# EAGLE design StairLightController (EAGLE 9.6.2)
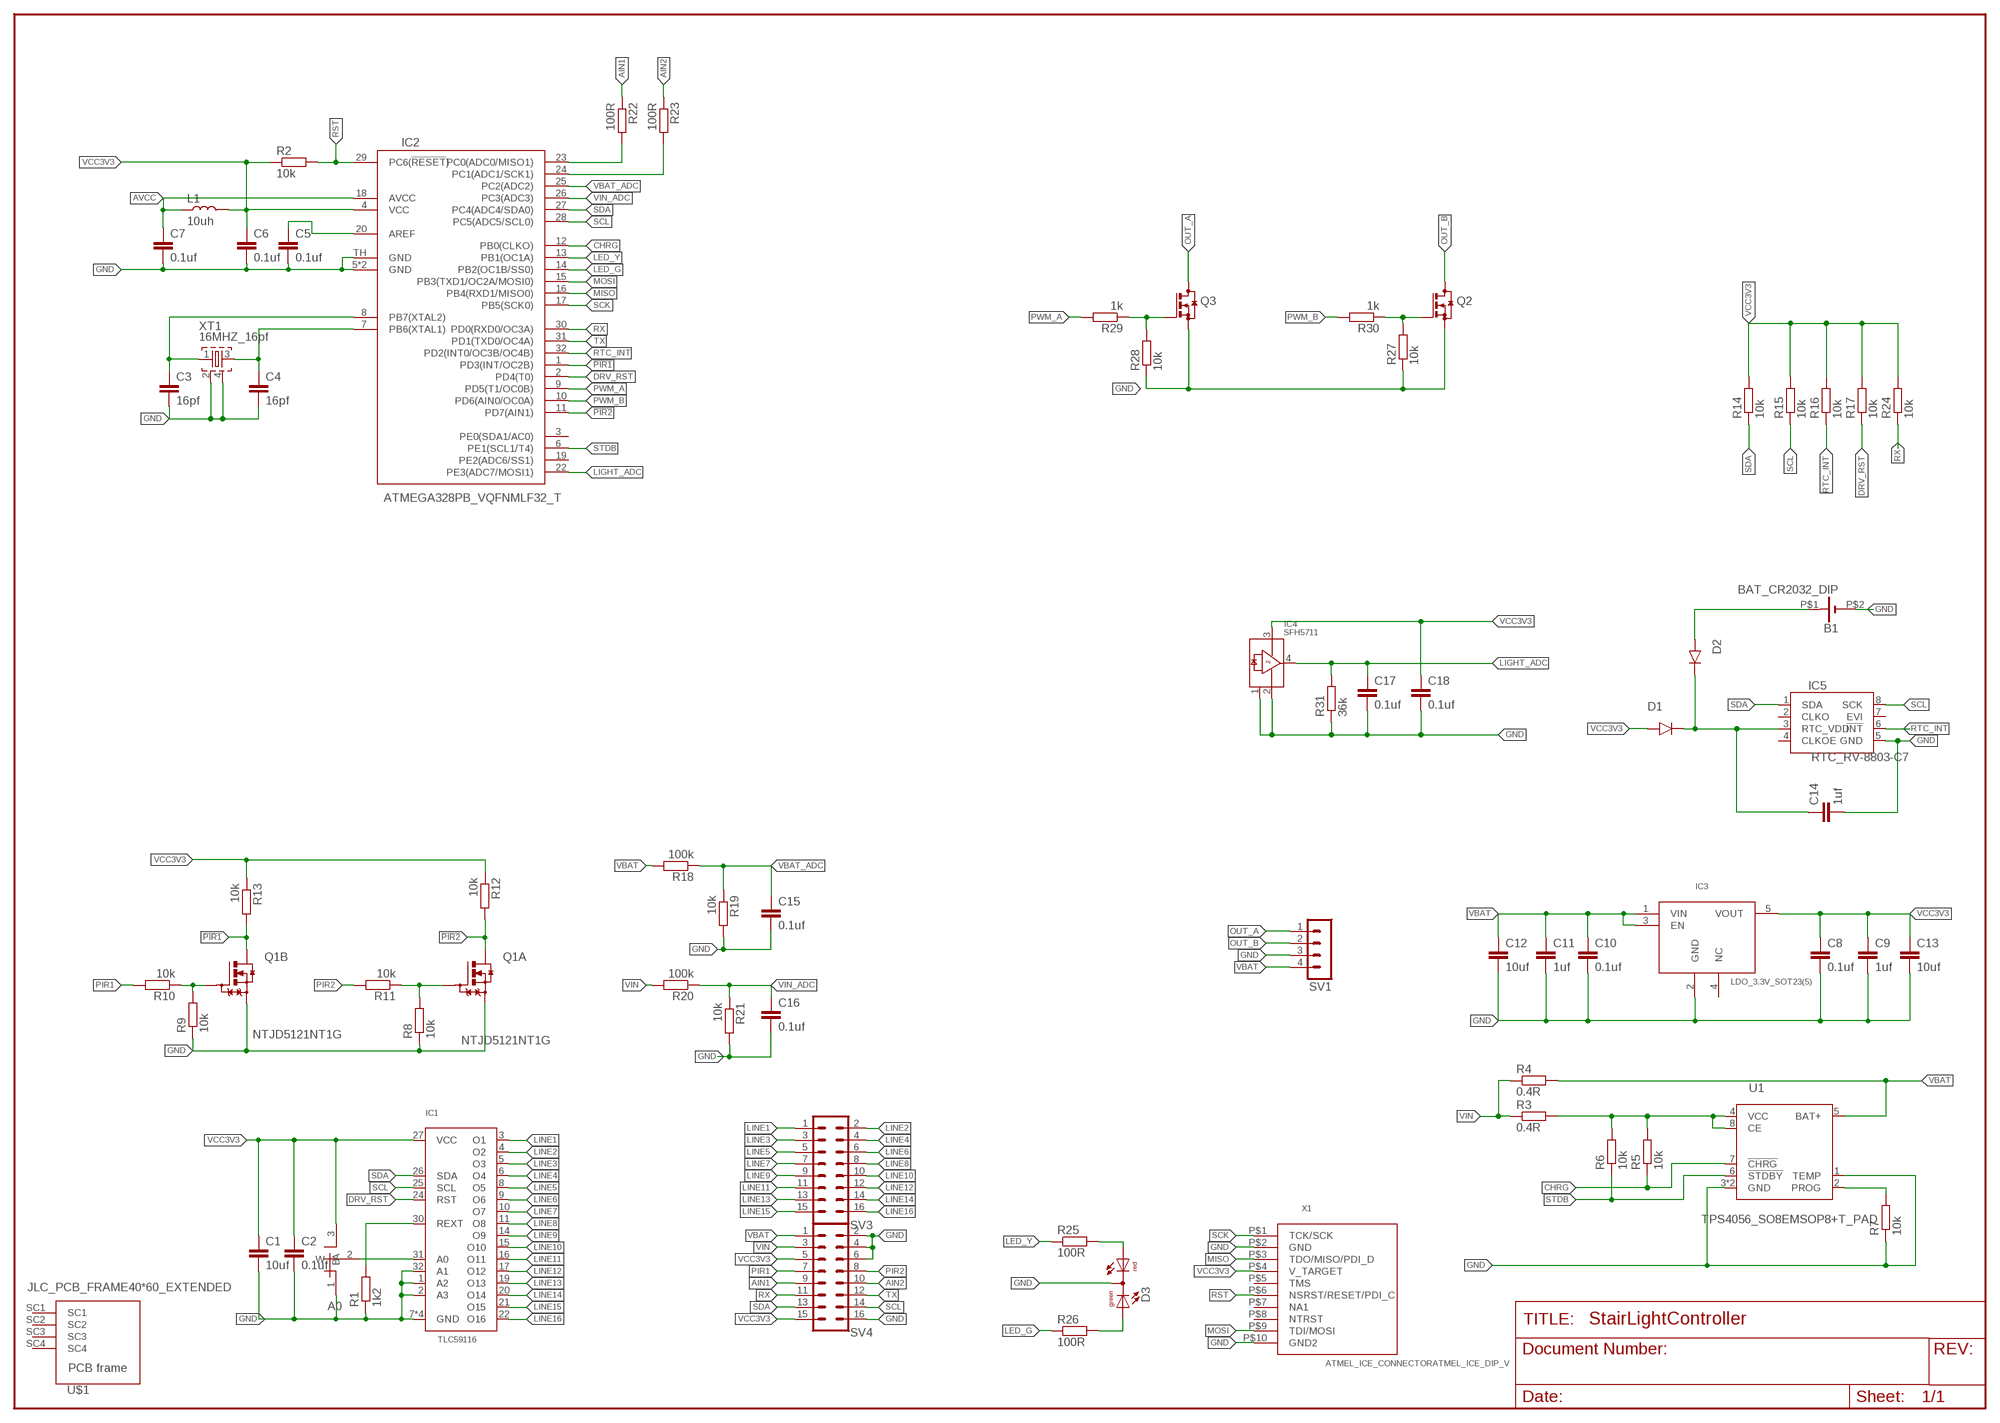
[diagram p0: schematic, sheet 1]

## Parts
A0  SMD_SWITCH_JUMPER  [0603_JUMP]
B1  BAT_CR2032_DIP  [CR2032_DIP]
C1  10uf  SMD_C0603  [0603]
C2  0.1uf  SMD_C0603  [0603]
C3  16pf  SMD_C0603  [0603]
C4  16pf  SMD_C0603  [0603]
C5  0.1uf  SMD_C0603  [0603]
C6  0.1uf  SMD_C0603  [0603]
C7  0.1uf  SMD_C0603  [0603]
C8  0.1uf  SMD_C0603  [0603]
C9  1uf  SMD_C0603  [0603]
C10  0.1uf  SMD_C0603  [0603]
C11  1uf  SMD_C0603  [0603]
C12  10uf  SMD_C1206  [1206]
C13  10uf  SMD_C1206  [1206]
C14  1uf  SMD_C0603  [0603]
C15  0.1uf  SMD_C0603  [0603]
C16  0.1uf  SMD_C0603  [0603]
C17  0.1uf  SMD_C0603  [0603]
C18  0.1uf  SMD_C0603  [0603]
D1  L1N4148WT1GSOD123_GALILE0_SMALL  [SOD-123_MINI-SMA]
D2  L1N4148WT1GSOD123_GALILE0_SMALL  [SOD-123_MINI-SMA]
D3  DUOLED5MM  [DUOLED5MM]
IC1  TLC59116  [MLF32-TH]
IC2  ATMEGA328PB_VQFNMLF32_T  [MLF32-TH]
IC3  LDO_3.3V_SOT23(5)  [SOT-23(5)]
IC4  SFH5711  [SFH5711]
IC5  RTC_RV-8803-C7  [C7_RTC]
L1  10uh  SMD_L0603  [0603]
Q1  NTJD5121NT1G  [SOT363]
Q2  BSS123SOT-23-3  [SOT-23(3)]
Q3  BSS123SOT-23-3  [SOT-23(3)]
R1  1k2  SMD_R0603  [0603]
R2  10k  SMD_R0603  [0603]
R3  0.4R  SMD_R1206  [1206]
R4  0.4R  SMD_R1206  [1206]
R5  10k  SMD_R0603  [0603]
R6  10k  SMD_R0603  [0603]
R7  10k  SMD_R0603  [0603]
R8  10k  SMD_R0603  [0603]
R9  10k  SMD_R0603  [0603]
R10  10k  SMD_R0603  [0603]
R11  10k  SMD_R0603  [0603]
R12  10k  SMD_R0603  [0603]
R13  10k  SMD_R0603  [0603]
R14  10k  SMD_R0603  [0603]
R15  10k  SMD_R0603  [0603]
R16  10k  SMD_R0603  [0603]
R17  10k  SMD_R0603  [0603]
R18  100k  SMD_R0603  [0603]
R19  10k  SMD_R0603  [0603]
R20  100k  SMD_R0603  [0603]
R21  10k  SMD_R0603  [0603]
R22  100R  SMD_R0603  [0603]
R23  100R  SMD_R0603  [0603]
R24  10k  SMD_R0603  [0603]
R25  100R  SMD_R0603  [0603]
R26  100R  SMD_R0603  [0603]
R27  10k  SMD_R0603  [0603]
R28  10k  SMD_R0603  [0603]
R29  1k  SMD_R0603  [0603]
R30  1k  SMD_R0603  [0603]
R31  36k  SMD_R0603  [0603]
SV1  MA04-1  [MA04-1]
SV3  MA08-2  [MA08-2]
SV4  MA08-2  [MA08-2]
U1  TPS4056_SO8EMSOP8+T_PAD  [EMSOP8+TPAD]
U$1  JLC_PCB_FRAME40*60_EXTENDED  [40X60_SENSOR_UNIT_OPEN]
X1  ATMEL_ICE_CONNECTORATMEL_ICE_DIP_V  [MINI10P_SPI/JTAG/PDI_DIP_V]
XT1  16MHZ_16pf  QUARTZ_ZQ  [QUARTZ_3X3MM]

## Nets
!PIR1: IC2.1(PD3(INT/OC2B)) Q1.3(B:D) R13.2
!PIR2: IC2.11(PD7(AIN1)) Q1.6(A:D) R12.2
AIN1: R22.1 SV4.9
AIN2: R23.1 SV4.10
AVCC: C7.1 IC2.18(AVCC) L1.1
CHRG: IC2.12(PB0(CLKO)) R5.1 U1.7(!CHRG)
DRV_RST: IC1.24(RST) IC2.2(PD4(T0)) R17.1
GND: A0.1(A) B1.P$2(-) C1.2 C2.2 C3.2 C4.2 C5.2 C6.2 C7.2 C8.2 C9.2 C10.2 C11.2 C12.2 C13.2 C14.2 C15.2 C16.2 C17.2 C18.2 D3.K(C) IC1.1(A2) IC1.2(A3) IC1.7(GND) IC1.18(GND) IC1.23(GND) IC1.32(A1) IC1.TH(GND) IC2.5(GND) IC2.21(GND) IC2.TH(GND) IC3.2(GND) IC4.1 IC4.2 IC5.5(GND) Q1.1(A:S) Q1.4(B:S) Q2.2(S) Q3.2(S) R1.1 R7.1 R8.1 R9.1 R19.2 R21.2 R27.1 R28.1 R31.1 SV1.3 SV4.2 SV4.4 SV4.6 SV4.16 U1.1(TEMP) U1.3(GND) U1.TPAD(GND) X1.P$2(GND) X1.P$10(GND2) XT1.2 XT1.4
LED_G: IC2.14(PB2(OC1B/SS0)) R26.1
LED_Y: IC2.13(PB1(OC1A)) R25.1
LIGHT_ADC: C17.1 IC2.22(PE3(ADC7/MOSI1)) IC4.4 R31.2
LINE1: IC1.3(O1) SV3.1
LINE2: IC1.4(O2) SV3.2
LINE3: IC1.5(O3) SV3.3
LINE4: IC1.6(O4) SV3.4
LINE5: IC1.8(O5) SV3.5
LINE6: IC1.9(O6) SV3.6
LINE7: IC1.10(O7) SV3.7
LINE8: IC1.11(O8) SV3.8
LINE9: IC1.14(O9) SV3.9
LINE10: IC1.15(O10) SV3.10
LINE11: IC1.16(O11) SV3.11
LINE12: IC1.17(O12) SV3.12
LINE13: IC1.19(O13) SV3.13
LINE14: IC1.20(O14) SV3.14
LINE15: IC1.21(O15) SV3.15
LINE16: IC1.22(O16) SV3.16
MISO: IC2.16(PB4(RXD1/MISO0)) X1.P$3(TDO/MISO/PDI_D)
MOSI: IC2.15(PB3(TXD1/OC2A/MOSI0)) X1.P$9(TDI/MOSI)
N$1: A0.2(W) IC1.31(A0)
N$2: IC1.30(REXT) R1.2
N$3: C3.1 IC2.8(PB7(XTAL2)) XT1.1
N$4: C4.1 IC2.7(PB6(XTAL1)) XT1.3
N$5: R7.2 U1.2(PROG)
N$6: R3.2 R5.2 R6.2 U1.4(VCC) U1.8(CE)
N$7: C5.1 IC2.20(AREF)
N$8: IC2.23(PC0(ADC0/MISO1)) R22.2
N$9: Q1.2(A:G) R8.2 R11.1
N$10: D3.AR R25.2
N$11: Q1.5(B:G) R9.2 R10.1
N$12: IC2.24(PC1(ADC1/SCK1)) R23.2
N$13: C14.1 D1.C D2.C IC5.3(RTC_VDD)
N$14: D3.AG R26.2
N$16: Q2.1(G) R27.2 R30.1
N$17: B1.P$1(+) D2.A
N$18: Q3.1(G) R28.2 R29.1
OUT_A: Q3.3(D) SV1.1
OUT_B: Q2.3(D) SV1.2
PIR1: R10.2 SV4.7
PIR2: R11.2 SV4.8
PWM_A: IC2.9(PD5(T1/OC0B)) R29.2
PWM_B: IC2.10(PD6(AIN0/OC0A)) R30.2
RST: IC2.29(PC6(!RESET!)) R2.2 X1.P$6(NSRST/RESET/PDI_C)
RTC_INT: IC2.32(PD2(INT0/OC3B/OC4B)) IC5.6(!INT) R16.1
RX: IC2.30(PD0(RXD0/OC3A)) R24.1 SV4.11
SCK: IC2.17(PB5(SCK0)) X1.P$1(TCK/SCK)
SCL: IC1.25(SCL) IC2.28(PC5(ADC5/SCL0)) IC5.8(SCK) R15.1 SV4.14
SDA: IC1.26(SDA) IC2.27(PC4(ADC4/SDA0)) IC5.1(SDA) R14.1 SV4.13
STDB: IC2.6(PE1(SCL1/T4)) R6.1 U1.6(!STDBY)
TX: IC2.31(PD1(TXD0/OC4A)) SV4.12
VBAT: C10.1 C11.1 C12.1 IC3.1(VIN) IC3.3(EN) R4.2 R18.2 SV1.4 SV4.1 U1.5(BAT+)
VBAT_ADC: C15.1 IC2.25(PC2(ADC2)) R18.1 R19.1
VCC3V3: A0.3(B) C1.1 C2.1 C6.1 C8.1 C9.1 C13.1 C18.1 D1.A IC1.27(VCC) IC2.4(VCC) IC3.5(VOUT) IC4.3 L1.2 R2.1 R12.1 R13.1 R14.2 R15.2 R16.2 R17.2 R24.2 SV4.5 SV4.15 X1.P$4(V_TARGET)
VIN: R3.1 R4.1 R20.2 SV4.3
VIN_ADC: C16.1 IC2.26(PC3(ADC3)) R20.1 R21.1
Unconnected: IC2.3(PE0(SDA1/AC0)) IC2.19(PE2(ADC6/SS1)) IC3.4(NC) IC5.2(CLKO) IC5.4(CLKOE) IC5.7(EVI) U$1.SC1 U$1.SC2 U$1.SC3 U$1.SC4 X1.P$5(TMS) X1.P$7(NA1) X1.P$8(NTRST)

## Library data of the parts
A0 = passive_components:SMD_SWITCH_JUMPER
B1 = passive_components:BAT_CR2032_DIP
C1-C18 = passive_components:SMD_C
D1 D2 = passive_components:L1N4148WT1G
D3 = led:DUOLED5MM: DUO LED 2 colors, 5 mm, round
IC1 = my_IC:TLC59116
IC2 = my_IC:ATMEGA328PB_VQFN
IC3 = my_IC:LDO_3.3V_SOT23(5)
IC4 = SFH5711:SFH5711; AVAILABILITY: Unavailable; DESCRIPTION: Optical Sensor Ambient 555nm Current 4-SMD, No Lead; MF: OSRAM Opto; MP: SFH5711; PACKAGE: SMD-4 OSRAM Opto; PRICE: None
IC5 = my_IC:RTC_RV-8803-C7
L1 = passive_components:SMD_L
Q1 = on-semiconductor-ntjd5121nt1g:NTJD5121NT1G: NTJD5121N, Dual N−Channel with ESD Power MOSFET 60 V, 295 mA, Dual N−Channel with ESD Protection, SC−88 Source: Datasheet <http://www.farnell.com/datasheets/1708304.pdf>; MF: ON SEMICONDUCTOR; MPN: NTJD5121NT1G; OC_FARNELL: 2317611; OC_NEWARK: unknown
Q2 Q3 = passive_components:BSS123: N-CHANNEL MOS FET
R1-R31 = passive_components:SMD_R
SV1 = con-lstb:MA04-1: PIN HEADER; OC_FARNELL: unknown; OC_NEWARK: unknown
SV3 SV4 = con-lstb:MA08-2: PIN HEADER; OC_FARNELL: unknown; OC_NEWARK: unknown
U1 = my_IC:TPS4056_SO8
U$1 = passive_components:JLC_PCB_FRAME
X1 = passive_components:ATMEL_ICE_CONNECTOR
XT1 = passive_components:QUARTZ_ZQ

## Board
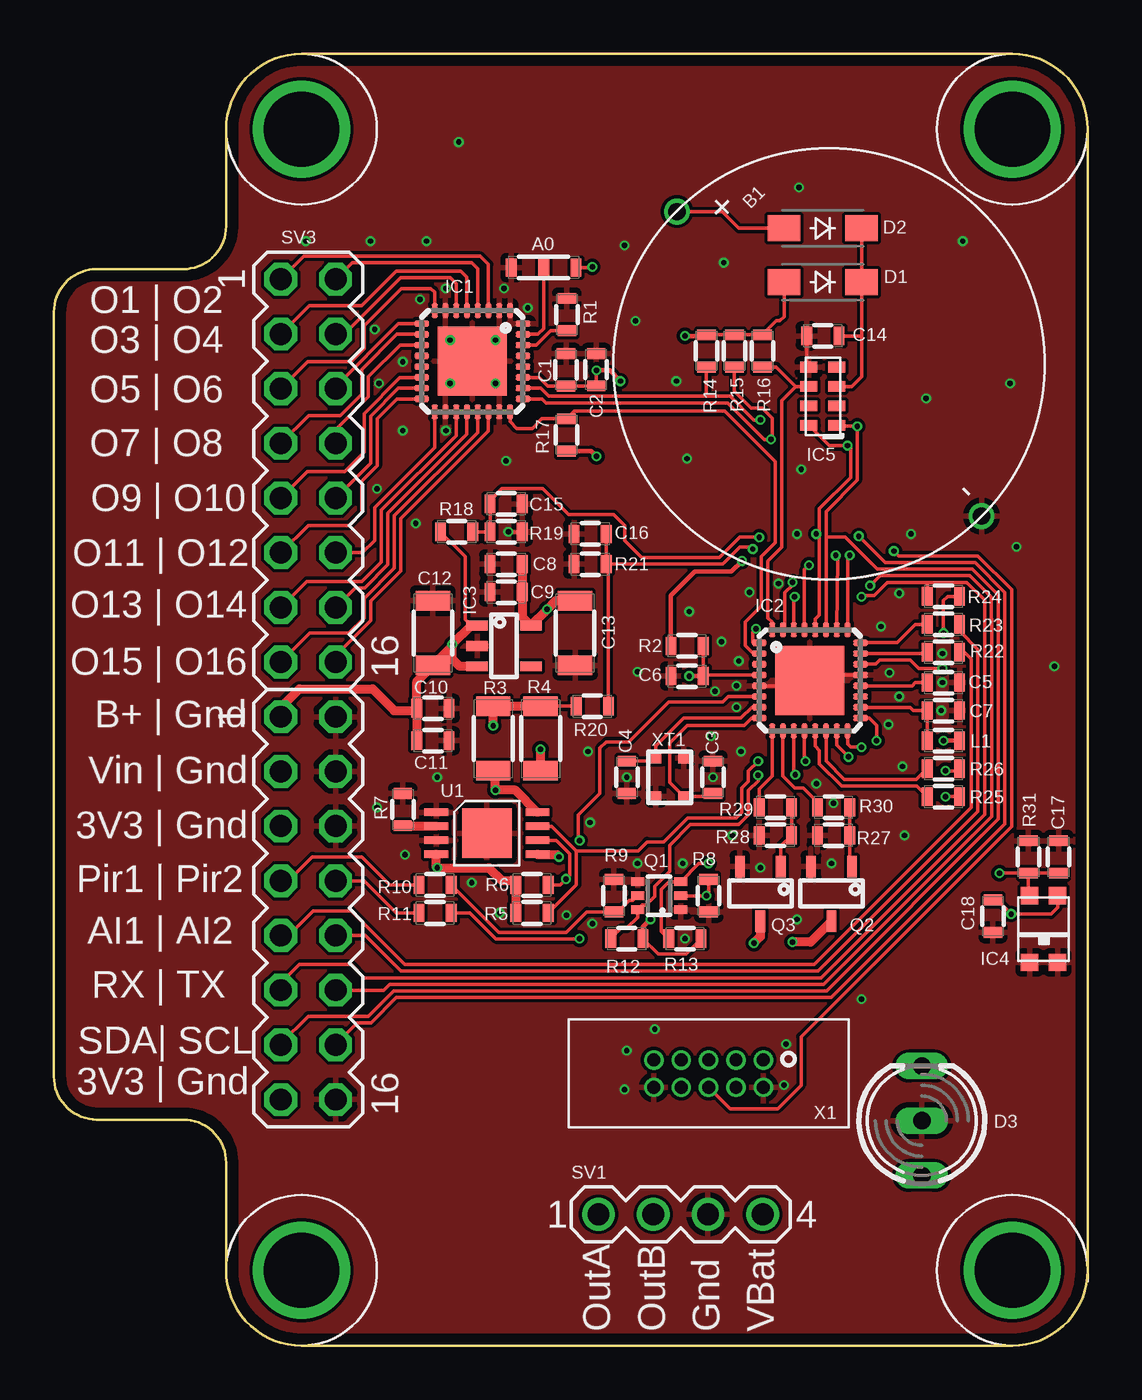
[diagram p1: board, top side]
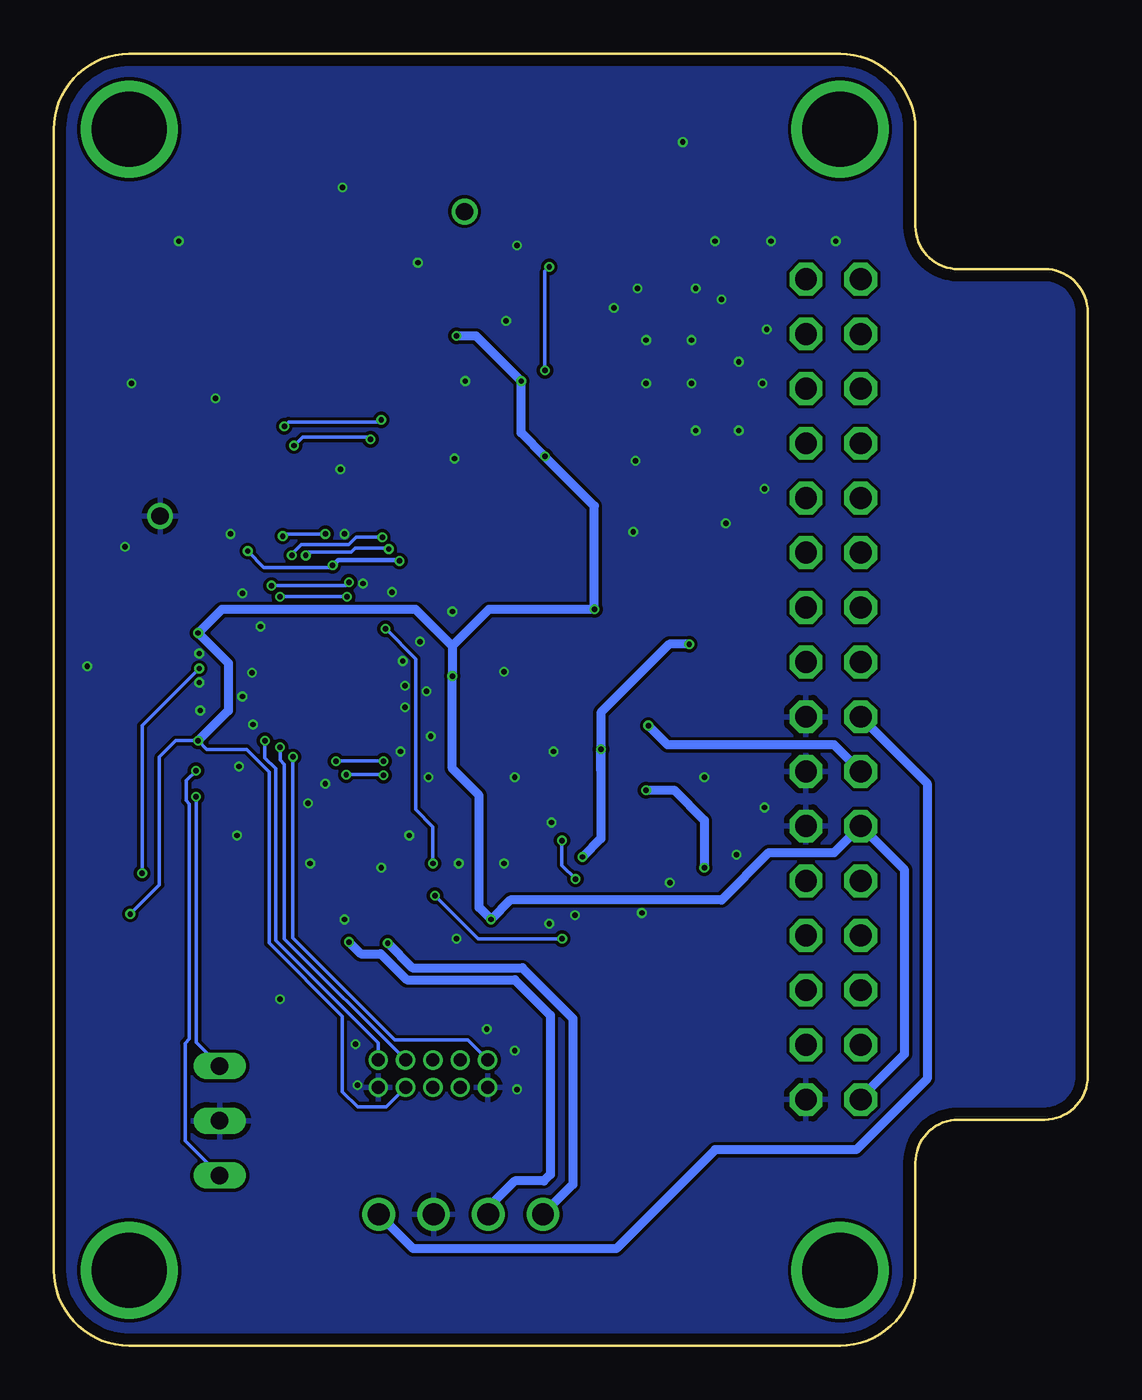
[diagram p2: board, bottom side, seen from below]

Size 48 x 60 mm. Coordinates in mm from the lower left corner, seen from the top.
Copper layers (1*16): Top 0.035mm / dielectric 0.15mm / Bottom 0.035mm
Design rules "default *": minimum track width 6mil, minimum drill 0.25mm, track to track 6mil, track to pad 6mil, pad to pad 6mil, via to via 6mil, smd to smd 6mil, copper to edge 20mil, drill to drill 6mil, minimum pad ring 4mil, minimum via ring 4mil, stop-mask expansion 4mil, vias tented up to drill 10mil, thermal gap 10mil

### Footprints (pad centres in the part's own frame; a part is rotated, then mirrored left to right if it is on the bottom)
0603_JUMP = smd 0.85 x 0.5: 1 0,0.75; 2 0,-0.75; 3 0,-2.25
CR2032_DIP = drill 0.8: P$1 -10,0; P$2 10,0
0603 = smd 0.85 x 0.5: 1 0,0.75; 2 0,-0.75
1206 = smd 1.6 x 0.9: 1 0,1.5; 2 0,-1.5
SOD-123_MINI-SMA = smd 1.5 x 1.2: A 1.8,0; C -1.8,0
DUOLED5MM = drill 0.813 long: AG -2.54,0; AR 2.54,0; K 0,0
MLF32-TH = smd 0.7 x 0.3: 1 -2.35,1.75; 2 -2.35,1.25; 3 -2.35,0.75; 4 -2.35,0.25; 5 -2.35,-0.25; 6 -2.35,-0.75; 7 -2.35,-1.25; 8 -2.35,-1.75; 17 2.35,-1.75; 18 2.35,-1.25; 19 2.35,-0.75; 20 2.35,-0.25; 21 2.35,0.25; 22 2.35,0.75; 23 2.35,1.25; 24 2.35,1.75 | smd 0.3 x 0.7: 9 -1.75,-2.35; 10 -1.25,-2.35; 11 -0.75,-2.35; 12 -0.25,-2.35; 13 0.25,-2.35; 14 0.75,-2.35; 15 1.25,-2.35; 16 1.75,-2.35; 25 1.75,2.35; 26 1.25,2.35; 27 0.75,2.35; 28 0.25,2.35; 29 -0.25,2.35; 30 -0.75,2.35; 31 -1.25,2.35; 32 -1.75,2.35 | smd 3.2 x 3.2: TH 0,0
SOT-23(5) = smd 0.45 x 1: 1 -0.95,-1.25; 2 0,-1.25; 3 0.95,-1.25; 4 0.95,1.25; 5 -0.95,1.25
SFH5711 = smd 0.8 x 0.8: 1 -0.65,-1.55; 2 0.65,-1.55; 3 0.65,1.55; 4 -0.65,1.55
C7_RTC = smd 0.8 x 0.5: 1 -0.65,1.35; 2 -0.65,0.45; 3 -0.65,-0.45; 4 -0.65,-1.35; 5 0.65,-1.35; 6 0.65,-0.45; 7 0.65,0.45; 8 0.65,1.35
SOT363 = smd 0.4 x 0.6: 1 -0.65,-1; 2 0,-1; 3 0.65,-1; 4 0.65,1; 5 0,1; 6 -0.65,1
SOT-23(3) = smd 0.45 x 1: 1 -0.95,-1.25; 2 0.95,-1.25; 3 0,1.29
MA04-1 = drill 1.016: 1 -3.81,0; 2 -1.27,0; 3 1.27,0; 4 3.81,0
MA08-2 = drill 1.016 octagon: 1 -8.89,-1.27; 2 -8.89,1.27; 3 -6.35,-1.27; 4 -6.35,1.27; 5 -3.81,-1.27; 6 -3.81,1.27; 7 -1.27,-1.27; 8 -1.27,1.27; 9 1.27,-1.27; 10 1.27,1.27; 11 3.81,-1.27; 12 3.81,1.27; 13 6.35,-1.27; 14 6.35,1.27; 15 8.89,-1.27; 16 8.89,1.27
EMSOP8+TPAD = smd 0.35 x 1.1: 1 -0.975,-2.35; 2 -0.325,-2.35; 3 0.325,-2.35; 4 0.975,-2.35; 5 0.975,2.35; 6 0.325,2.35; 7 -0.325,2.35; 8 -0.975,2.35 | smd 2.3 x 2.3: TPAD 0,0
40X60_SENSOR_UNIT_OPEN = drill 3.5: SC1 3.5,56.5; SC2 36.5,56.5; SC3 3.5,3.5; SC4 36.5,3.5
MINI10P_SPI/JTAG/PDI_DIP_V = drill 0.6: P$1 -2.54,-1.27; P$2 -2.54,0; P$3 -1.27,-1.27; P$4 -1.27,0; P$5 0,-1.27; P$6 0,0; P$7 1.27,-1.27; P$8 1.27,0; P$9 2.54,-1.27; P$10 2.54,0
QUARTZ_3X3MM = smd 0.5 x 0.5: 1 -0.65,0.9; 2 0.65,0.9; 3 0.65,-0.9; 4 -0.65,-0.9

### Placement (x,y rotation side)
A0  21.99,50.07 90 top
B1  36,45.6 315 top
C1  23.78,45.32 180 top
C2  25.18,45.33 180 top
C3  30.6,26.4 180 top
C4  26.6,26.4 0 top
C5  41.3,30.8 90 top
C6  29.4,31.1 270 top
C7  41.3,29.5 90 top
C8  21,36.3 270 top
C9  21,35 270 top
C10  17.6,29.6 90 top
C11  17.6,28.1 90 top
C12  17.6,33.1 180 top
C13  24.2,33.1 0 top
C14  35.7,46.9 270 top
C15  21,39.1 90 top
C16  24.9,37.7 270 top
C17  46.65,22.7 180 top
C18  43.6,19.95 0 top
D1  35.7,49.4 180 top
D2  35.7,51.9 180 top
D3  40.3,10.45 90 top
IC1  19.43,45.72 270 top
IC2  35.1,30.9 0 top
IC3  20.9,32.5 270 top
IC4  45.95,19.35 0 top
IC5  35.7,44.1 180 top
L1  41.3,28.1 90 top
Q1  28.1,20.9 90 top
Q2  36.1,21 180 top
Q3  32.8,21 180 top
R1  23.82,47.89 0 top
R2  29.4,32.5 270 top
R3  20.4,28.2 0 top
R4  22.6,28.2 0 top
R5  22.2,20.1 270 top
R6  22.2,21.4 270 top
R7  16.2,24.9 0 top
R8  30.4,20.9 180 top
R9  26,20.9 0 top
R10  17.7,21.4 270 top
R11  17.7,20.1 270 top
R12  26.6,18.9 270 top
R13  29.3,18.9 270 top
R14  30.3,46.2 180 top
R15  31.6,46.2 180 top
R16  32.9,46.2 180 top
R17  23.8,42.3 0 top
R18  18.7,37.8 270 top
R19  21,37.8 90 top
R20  25,29.7 270 top
R21  24.9,36.3 270 top
R22  41.3,32.2 270 top
R23  41.3,33.5 270 top
R24  41.3,34.8 90 top
R25  41.3,25.5 90 top
R26  41.3,26.8 90 top
R27  36.2,23.7 90 top
R28  33.5,23.7 90 top
R29  33.5,25 270 top
R30  36.2,25 270 top
R31  45.25,22.7 0 top
SV1  29.1,6.1 0 top
SV3  11.81,40.64 270 top
SV4  11.81,20.32 270 top
U1  20.1,23.8 270 top
U$1  8,0 0 top
X1  30.4,12 180 top
XT1  28.6,26.4 180 top

### Tracks (layer width: path | path; a pad name or v marks a point on that pad's centre or on a via)
!PIR1  (via drill 0.25)
  Top 0.152: R13.2 28.2,19.25 28.2,21.2 28.55,21.55 Q1.3 29.95,22.4 v30.4,22.4 | v32.6,33.3 32.45,33.15 32.45,32.65 IC2.1
  Bottom 0.152: v30.4,22.4 30.4,24.1 31.2,24.9 31.2,31.9 v32.6,33.3
!PIR2  (via drill 0.25)
  Top 0.152: R12.2 26.35,19.4 26.6,19.4 27.1,19.9 Q1.6 27.32,20.47 27.5,20.47 27.89,20.87 27.89,21.33 28.6,22.03 28.6,23.24 29.56,24.2 31.8,24.2 32.25,24.64 32.25,25.78 32.7,26.23 v32.7,26.5 | v34.42,26.52 34.35,26.59 IC2.11
  Bottom 0.152: v32.7,26.5 32.72,26.52 v34.42,26.52
AIN1
  Top 0.152: SV4.9 10.9,19.05 | 10.9,19.05 10.95,19.05 | R22.1 42.3,32.2 42.6,31.9 42.6,25 35.3,17.7 16.3,17.7 13.8,20.2 12.05,20.2 10.9,19.05
AIN2
  Top 0.152: SV4.10 14.45,19.05 16.11,17.39 35.5,17.39 42.91,24.8 42.91,32.34 42.05,33.2 R23.1
AVCC
  Top 0.152: IC2.18 39.75,29.65 39.9,29.5 40.5,29.5 | 40.5,29.5 C7.1 | L1.1 40.55,29.45 40.5,29.5
CHRG  (via drill 0.25)
  Top 0.152: U1.7 23.11,24.12 24.25,22.98 | R5.1 24.25,21.41 24.25,22.98 | 24.25,22.98 27.13,22.98 27.55,23.4 28.32,23.4 29.43,24.5 31.67,24.5 31.94,24.77 31.94,25.9 32.25,26.21 32.25,26.69 v32.7,27.14 v32.7,27.15 | v34.9,27.15 34.85,27.2 IC2.12
  Bottom 0.152: v32.7,27.15 v34.9,27.15
DRV_RST
  Top 0.152: IC1.24 21.18,42.92 21.5,42.6 22.2,42.6 22.65,43.05 R17.1 24.15,43.4 31.15,43.4 33.5,41.05 33.5,37.3 32.84,36.65 32.84,34.34 32.1,33.6 32.1,32.52 32.47,32.15 IC2.2
GND  (via drill 0.25)
  Top 0.152: IC1.TH 20.41,46.7 v20.5,46.7 | IC1.TH 19.48,45.72 v20.5,44.7 | IC1.TH v18.41,44.7 v18.4,44.7 | IC2.5 34.85,30.65 IC2.TH 35.4,31.2 36.2,31.2 36.25,31.15 IC2.21 | IC5.5 34.95,45.55 C14.2 | R19.2 v21.1,37.8
  other vias: 18.2,42.5 16.2,42.5 15,39.8 15.1,44.7 16.2,45.7 14.9,47.2 17,48.6 11.7,51.3 14.7,51.3 17.3,51.3 16.8,38.2 18.4,46.7 18.2,49.1 20.9,49.1 22,48.2 26.6,26.4 30.6,26.4 19.4,21.5 20.7,20.1 23.8,20 29.3,18.9 25,19.6 27.1,22.4 29.2,22.4 34,14 33.9,12.1 26.6,13.7 26.5,11.9 27.9,14.7 37.5,16.1 34.5,19.8 39.5,23.7 39.4,26.9 38.75,28.85 39.25,30.15 46.45,31.55 31,32.7 29.5,34.1 32.3,35 33.65,35.4 34.5,37.7 38.4,33.4 39.8,37.7 44.7,37.1 34.7,40.7 29.4,41.2 28.9,44.8 27,47.6 26.5,51.1 31.1,50.3 34.6,53.8 42.2,51.3 40.5,44 44.4,44.7 18.8,55.9 21,41.1 17.8,26.4 16.3,22.8 15,25 24.9,24.3 27.1,31.3 24.8,27.6 36.2,25.2 35.4,26.1 36.1,22.4 32.8,22.2 31.5,23.7 31.9,27.6 30.5,28.3 31.7,30.65 30.7,30.4 31.8,31.8 41.2,29.5 41.25,32.15 41.25,30.8 31.7,29.65 39.25,34.95 38.8,31.25
  pour Top: -0.2,59.5 8.1,59.5 8.9,60.3 46.9,60.3 48.2,59 48.2,-0.8 48.1,-0.9 1.7,-0.9 0.3,0.5 0.3,59
  pour Bottom: -1.5,59.8 47,59.8 49.6,57.2 49.6,0.2 49.2,-0.2 48.8,-0.6 1.7,-0.6 -0.8,1.9 -0.8,21.1 -0.8,57.7 -1.6,58.5 -1.6,59.7
LED_G
  Top 0.152: R26.1 40.05,26.3 36.7,26.3 35.85,27.15 IC2.14
LED_Y
  Top 0.152: IC2.13 35.35,27.85 35.55,27.66 35.55,27.02 36.57,26 40.05,26 R25.1
LIGHT_ADC  (via drill 0.25)
  Top 0.152: R31.2 45.25,20.95 IC4.4 | R31.2 C17.1 | R31.2 v43.9,21.95 | v41.25,31.45 40.9,31.45 40.15,31.45 39.75,31.84 38.34,31.84 38.15,31.65 IC2.22
  Bottom 0.152: v43.9,21.95 43.9,28.8 v41.25,31.45
LINE1
  Top 0.152: IC1.3 20.18,50.22 19.8,50.6 11.61,50.6 SV3.1
LINE2
  Top 0.152: IC1.4 19.68,50.02 19.4,50.3 13.84,50.3 SV3.2
LINE3
  Top 0.152: IC1.5 19.18,49.62 18.9,49.9 15.9,49.9 14.3,48.3 11.85,48.3 SV3.3
LINE4
  Top 0.152: IC1.6 18.68,49.31 18.4,49.59 16.09,49.59 13.49,46.99 SV3.4
LINE5
  Top 0.152: IC1.8 17.68,48.92 17.5,49.1 16.13,49.1 14.4,47.37 14.4,46.3 13.8,45.7 11.79,45.7 SV3.5
LINE6
  Top 0.152: IC1.9 16,47.47 13.08,44.55 SV3.6
LINE7
  Top 0.152: IC1.10 15.93,46.97 14.3,45.34 14.3,44.2 13.3,43.2 11.83,43.2 SV3.7
LINE8
  Top 0.152: IC1.11 16.07,46.47 14.61,45 14.61,44.07 13.08,42.55 SV3.8
LINE9
  Top 0.152: IC1.14 16.07,44.97 14.4,43.3 14.4,41.5 13.5,40.6 11.77,40.6 SV3.9
LINE10
  Top 0.152: IC1.15 16,44.47 14.71,43.17 14.71,40.99 SV3.10
LINE11
  Top 0.152: IC1.16 15.93,43.97 15.01,43.05 15.01,40.87 14.3,40.16 14.3,38.7 13.7,38.1 11.81,38.1 SV3.11
LINE12
  Top 0.152: IC1.17 17.68,41.71 14.89,38.93 14.89,37.4 14.33,36.83 SV3.12
LINE13
  Top 0.152: IC1.19 18.68,42.28 15.2,38.8 15.2,36.4 14.3,35.5 11.75,35.5 SV3.13
LINE14
  Top 0.152: IC1.20 19.18,42.35 15.5,38.67 15.5,36.27 14.43,35.2 13.98,35.2 SV3.14
LINE15
  Top 0.152: IC1.21 19.68,42.42 15.81,38.55 15.81,36.11 14.4,34.7 14.4,33.8 13.7,33.1 11.89,33.1 SV3.15
LINE16
  Top 0.152: IC1.22 20.18,42.49 16.11,38.42 16.11,35.98 14.71,34.57 14.71,33.67 13.08,32.05 SV3.16
MISO  (via drill 0.25)
  Top 0.152: IC2.16 36.85,27.95 37,27.8 v37.5,27.8
  Bottom 0.152: v37.5,27.8 37.5,27.2 37.3,27 37.3,18.9 X1.P$3
MOSI  (via drill 0.25)
  Top 0.152: IC2.15 36.35,27.89 v36.9,27.34
  Bottom 0.152: v36.9,27.34 36.9,18.93 32.17,14.2 28.79,14.2 X1.P$9
N$1
  Top 0.152: IC1.31 22.47,46.97 22.74,47.24 A0.2
N$2
  Top 0.152: IC1.30 22.4,46.47 23.07,47.14 R1.2
N$3
  Top 0.152: C3.1 30.45,25.5 XT1.1 28.6,26.15 28.6,28 29.4,28.8 32.05,28.8 32.4,29.15 IC2.8
N$4
  Top 0.152: C4.1 27.8,27.15 XT1.3 27.95,27.85 29.25,29.15 31.9,29.15 32.4,29.65 IC2.7
N$5
  Top 0.406: U1.2 16.23,24.12 R7.2
N$6  (via drill 0.25)
  Top 0.406: U1.8 21.43,25.8 v20.5,25.8 20.5,26.6 R3.2 | U1.4 17.75,22.25 v17.8,22.2 20.2,22.2 20.8,21.6 21.25,21.6 R6.2 R5.2
  Bottom 0.406: v20.5,25.8 19.2,25.8 17.8,24.4 v17.8,22.2
N$7
  Top 0.152: IC2.20 39.85,30.65 40,30.8 C5.1
N$8
  Top 0.152: IC2.23 40.5,32.15 R22.2
N$9  (via drill 0.25)
  Top 0.152: R11.1 19.32,20.1 20.52,18.89 23.93,18.89 23.93,18.9 v24.4,18.9 | R8.2 30.4,21 v30.3,20.9 Q1.2
  Bottom 0.152: v24.4,18.9 28.3,18.9 v30.3,20.9
N$10  (via drill 0.25)
  Top 0.152: R25.2 v41.4,25.5
  Bottom 0.152: v41.4,25.5 41.4,14.09 D3.AR
N$11
  Top 0.152: R10.1 20.65,19.2 23.8,19.2 24.75,20.15 R9.2 26.18,20.15 26.7,20.68 26.88,20.68 Q1.5
N$12
  Top 0.152: IC2.24 39.15,32.65 40,33.5 R23.2
N$13
  Top 0.152: D2.C D1.C 37.5,46.9 | 37.5,46.9 37.5,45 37.05,44.55 IC5.3 | C14.1 37.5,46.9
N$14  (via drill 0.25)
  Top 0.152: R26.2 41.95,26.7 v41.4,26.7
  Bottom 0.152: v41.4,26.7 41.85,26.25 41.85,25.31 41.7,25.16 41.7,14.24 41.9,14.05 41.9,9.51 D3.AG
N$16
  Top 0.152: R30.1 R27.2 36.95,22.35 Q2.1
N$17
  Top 0.152: B1.P$1 31.03,52.67 31.8,51.9 D2.A
N$18
  Top 0.152: Q3.1 33.75,23.2 R28.2 R29.1
OUT_A  (via drill 0.25)
  Top 0.406: Q3.3 32.8,19 v32.5,18.7
  Bottom 0.406: v32.5,18.7 31.35,17.55 26.25,17.55 23.9,15.2 23.9,7.49 SV1.1
OUT_B  (via drill 0.25)
  Top 0.406: Q2.3 35.14,18.75 v34.3,18.75
  Bottom 0.406: v34.3,18.75 33.75,18.2 32.82,18.2 31.61,16.99 26.59,16.99 24.95,15.35 24.95,7.95 25.25,7.65 26.6,7.65 27.83,6.42 SV1.2
PIR1
  Top 0.152: SV4.7 10.89,21.59 12,22.7 14.3,22.7 15.6,21.4 R10.2
PIR2
  Top 0.152: SV4.8 14.41,21.59 15.9,20.1 R11.2
PWM_A
  Top 0.152: R29.2 32.75,25.85 33.35,26.45 IC2.9
PWM_B
  Top 0.152: R30.2 35.45,25.25 34.8,25.9 34.4,25.9 33.85,26.45 IC2.10
RST  (via drill 0.25)
  Top 0.152: IC2.29 34.85,36.05 v35.05,36.25 | v39,36.91 39.23,36.67 42.9,36.67 44.46,35.11 44.46,24.11 34.7,14.35 34.7,12.1 33.6,11 31.4,11 X1.P$6
  Top 0.203: v31.95,36.45 31.45,35.95 29.75,35.95 28.65,34.85 R2.2
  Bottom 0.152: v35.05,36.25 35.16,36.15 38.25,36.15 v39,36.9 v39,36.91
  Bottom 0.203: v35.05,36.25 34.8,36.5 32,36.5 v31.95,36.45
RTC_INT
  Top 0.152: IC5.6 34.45,44.55 | IC2.32 33.35,33.6 33.15,33.8 33.15,36.45 33.8,37.1 33.8,43.9 34.45,44.55 | 34.45,44.55 33.55,45.45 R16.1
RX  (via drill 0.25)
  Top 0.152: IC2.30 34.35,34.74 v34.39,34.78 | 40.4,34.8 R24.1 40.55,35.45 | SV4.11 10.54,16.84 11.4,17.7 13.8,17.7 14.41,17.09 35.62,17.09 43.21,24.68 43.21,34.64 42.4,35.45 40.55,35.45 | v37.5,34.78 37.56,34.84 38.09,34.84 38.7,35.45 40.55,35.45
  Bottom 0.152: v34.39,34.78 v37.5,34.78
SCK  (via drill 0.25)
  Top 0.152: IC2.17 37.85,29.15 38.2,28.8 v38.2,28.1
  Bottom 0.152: v38.2,28.1 38.2,27.3 37.7,26.8 37.7,18.83 32.94,14.07 X1.P$1
SCL  (via drill 0.25)
  Top 0.152: IC1.25 22.67,43.97 22.85,43.79 31.28,43.79 32.98,42.09 v33.3,42.09 33.36,42.15 33.36,43.09 32.89,43.55 32.38,43.55 31.6,44.33 R15.1 | 35.38,42.75 IC5.8 36,41.8 v36.84,41.8 37,41.8 37,40.33 35.55,38.88 35.55,37.7 | IC2.28 35.35,33.75 35.55,33.95 35.55,37.7 | 35.55,37.7 v35.39,37.7 | v37.37,37.6 38.6,36.37 42.77,36.37 44.16,34.98 44.16,24.23 36.1,16.18 15.91,16.18 14.73,14.99 14.09,14.99 | 13.9,14.8 14.09,14.99 | 14.09,14.99 14.09,14.98 SV4.14
  Bottom 0.152: v33.3,42.09 33.4,42.19 36.45,42.19 v36.84,41.8 | v37.37,37.6 37.27,37.7 v35.39,37.7
SDA  (via drill 0.25)
  Top 0.152: IC1.26 22.6,44.47 22.98,44.09 30.3,44.09 | v32.8,43 32.5,43 31.41,44.09 30.3,44.09 | 35.85,37.56 35.85,38.75 37.3,40.2 v37.3,42.7 36.4,42.7 IC5.1 | R14.1 30.3,44.09 | 35.85,37.56 36.74,37.56 38.24,36.06 42.65,36.06 43.85,34.86 43.85,24.46 35.87,16.48 15.78,16.48 14.6,15.3 11.8,15.3 10.54,14.04 SV4.13 | IC2.27 35.85,37.56
  Bottom 0.152: v32.8,43 32.9,42.9 37.1,42.9 v37.3,42.7
STDB  (via drill 0.25)
  Top 0.152: U1.6 23.32,23.48 23.95,22.85 23.95,21.85 v23.77,21.68 23.5,21.4 R6.1 | v24.41,23.46 24.35,23.52 24.35,24.65 25.35,25.65 25.35,27.75 25.65,28.05 26.7,28.05 28.55,29.91 31.05,29.91 31.3,30.15 IC2.6
  Bottom 0.152: v24.41,23.46 24.41,22.31 v23.77,21.68
TX  (via drill 0.25)
  Top 0.152: v34.3,35.45 34.3,35.33 33.94,34.97 33.94,33.34 IC2.31 | v37.9,35.3 38.36,35.76 42.52,35.76 43.51,34.77 43.51,33.79 43.55,33.75 43.55,24.59 35.75,16.79 15.59,16.79 15.31,16.51 SV4.12
  Bottom 0.152: v37.9,35.3 34.45,35.3 v34.3,35.45
VBAT  (via drill 0.25)
  Top 0.152: R18.2 19.1,36.65 19.1,33.72 19.37,33.45
  Top 0.406: SV4.1 10.54,29.64 11.4,30.5 14.8,30.5 15.8,29.5 16.75,29.5 C10.1 | C10.1 C11.1 | C10.1 16.85,30.85 C12.1 18.5,32.5 | IC3.1 19.37,33.45 v18.5,32.58 18.5,32.5 | 18.5,32.5 18.5,31.9 18.85,31.55 IC3.3 | v23.45,22.7 23.35,22.8 22.48,22.8 U1.5 | R4.2 v22.6,27.7
  Bottom 0.406: R4.2 v22.6,27.7 | v22.6,27.7 22.6,23.55 v23.45,22.7 | v18.5,32.58 19.42,32.58 22.6,29.4 v22.6,27.7 | SV4.1 7.45,26.12 7.45,12.4 10.75,9.1 17.3,9.1 21.9,4.5 31.31,4.5 SV1.4
VBAT_ADC  (via drill 0.25)
  Top 0.152: R18.1 R19.1 C15.1 20.25,39.25 20.8,39.8 22.7,39.8 23.9,38.6 26,38.6 26.5,38.1 26.5,37.4 27.3,36.6 30.91,36.6 31.85,37.55 v32.75,37.55 | v36.95,36.71 36.86,36.71 IC2.25
  Bottom 0.152: v36.95,36.71 36.95,36.76 36.51,37.2 34.3,37.2 33.95,37.55 v32.75,37.55
VCC3V3  (via drill 0.25)
  Top 0.152: IC1.27 22.53,44.97 22.93,44.57 C1.1 C2.1 25.18,45.28 v25.2,45.3 | v25,50.1 24.97,50.07 A0.3 | IC2.4 30.2,31.15 C6.1 R2.1 | R12.1 28.05,18.2 29.35,18.2 R13.1 | R14.2 R15.2 R16.2 33.55,47.6 33.7,47.6 33.9,47.8 D1.A | R24.2 41.5,34.8 41.3,34.6 v41.3,33.1 | IC4.3 46.6,20.35 46.3,20.05 v44.45,20.05 43.8,20.7 C18.1
  Top 0.203: R14.2 30.25,46.9 v29.3,46.9 | v25.2,45.3 25.8,45.3 v26.3,44.8 | R17.2 24.95,41.55 v25.2,41.3 | C6.1 v29.5,31.1 | L1.2 v41.3,28.1 | R12.1 27.35,19.45 v27.7,19.8
  Top 0.406: C8.1 C9.1 21.75,33.85 IC3.5 v22.9,34.2 23.3,34.6 C13.1
  Bottom 0.152: v25.2,45.3 25.2,49.9 v25,50.1 | X1.P$4 32.57,11.1 33.9,11.1 34.6,11.8 34.6,15.3 38,18.7 38,26.66 39.05,27.7 40.9,27.7 v41.3,28.1 42.35,28.1 43.1,27.35 43.1,21.4 v44.45,20.05
  Bottom 0.406: v29.3,46.9 28.4,46.9 v26.3,44.8 26.3,42.4 v25.2,41.3 22.9,39 v22.9,34.2 27.8,34.2 29.5,32.5 | 29.5,32.5 31.2,34.2 40.2,34.2 v41.3,33.1 39.9,31.7 39.9,29.5 v41.3,28.1 | 29.5,32.5 v29.5,31.1 29.5,26.8 28.25,25.55 28.25,20.35 v27.7,19.8 26.8,20.7 17,20.7 14.8,22.9 11.77,22.9 SV4.5 8.5,22.09 8.5,13.55 10.54,11.51 SV4.15
VIN  (via drill 0.25)
  Top 0.152: R4.1 R20.2
  Top 0.406: v20.4,28.8 R3.1 R4.1
  Bottom 0.406: SV4.3 11.77,27.9 19.5,27.9 v20.4,28.8
VIN_ADC  (via drill 0.25)
  Top 0.152: R20.1 25.75,36.2 R21.1 | R21.1 C16.1 | v32.45,37 32.35,37.1 31.85,37.1 31.05,36.3 R21.1 | v36.3,36.7 36.3,36.64 36.39,36.55 36.36,33.34 36.35,33.34 IC2.26
  Bottom 0.152: v32.45,37 32.5,37.05 34,37.05 34.2,36.85 36.16,36.85 v36.3,36.7

### Text on the board
tPlace: O1 | O2 | O3 | O4 | O5 | O6 | O7 | O8 | O9 | O10 | O11 | O12 | O13 | O14 | O15 | O16 | B+ | Gnd | Vin | Gnd | 3V3 | Gnd | Pir1 | Pir2 | AI1 | AI2 | RX | TX | SDA| SCL | 3V3 | Gnd | OutA / OutB / Gnd / VBat